# Altium schematic sheet HV_DCDC_EVM_Release_V100.SchDoc
size A2; Organization: Altium Limited; Address1: L3, 12a Rodborough Rd; Address2: Frenchs Forest; Address3: NSW; Address4: Australia 2086; SheetNumber: 1; SheetTotal: 1
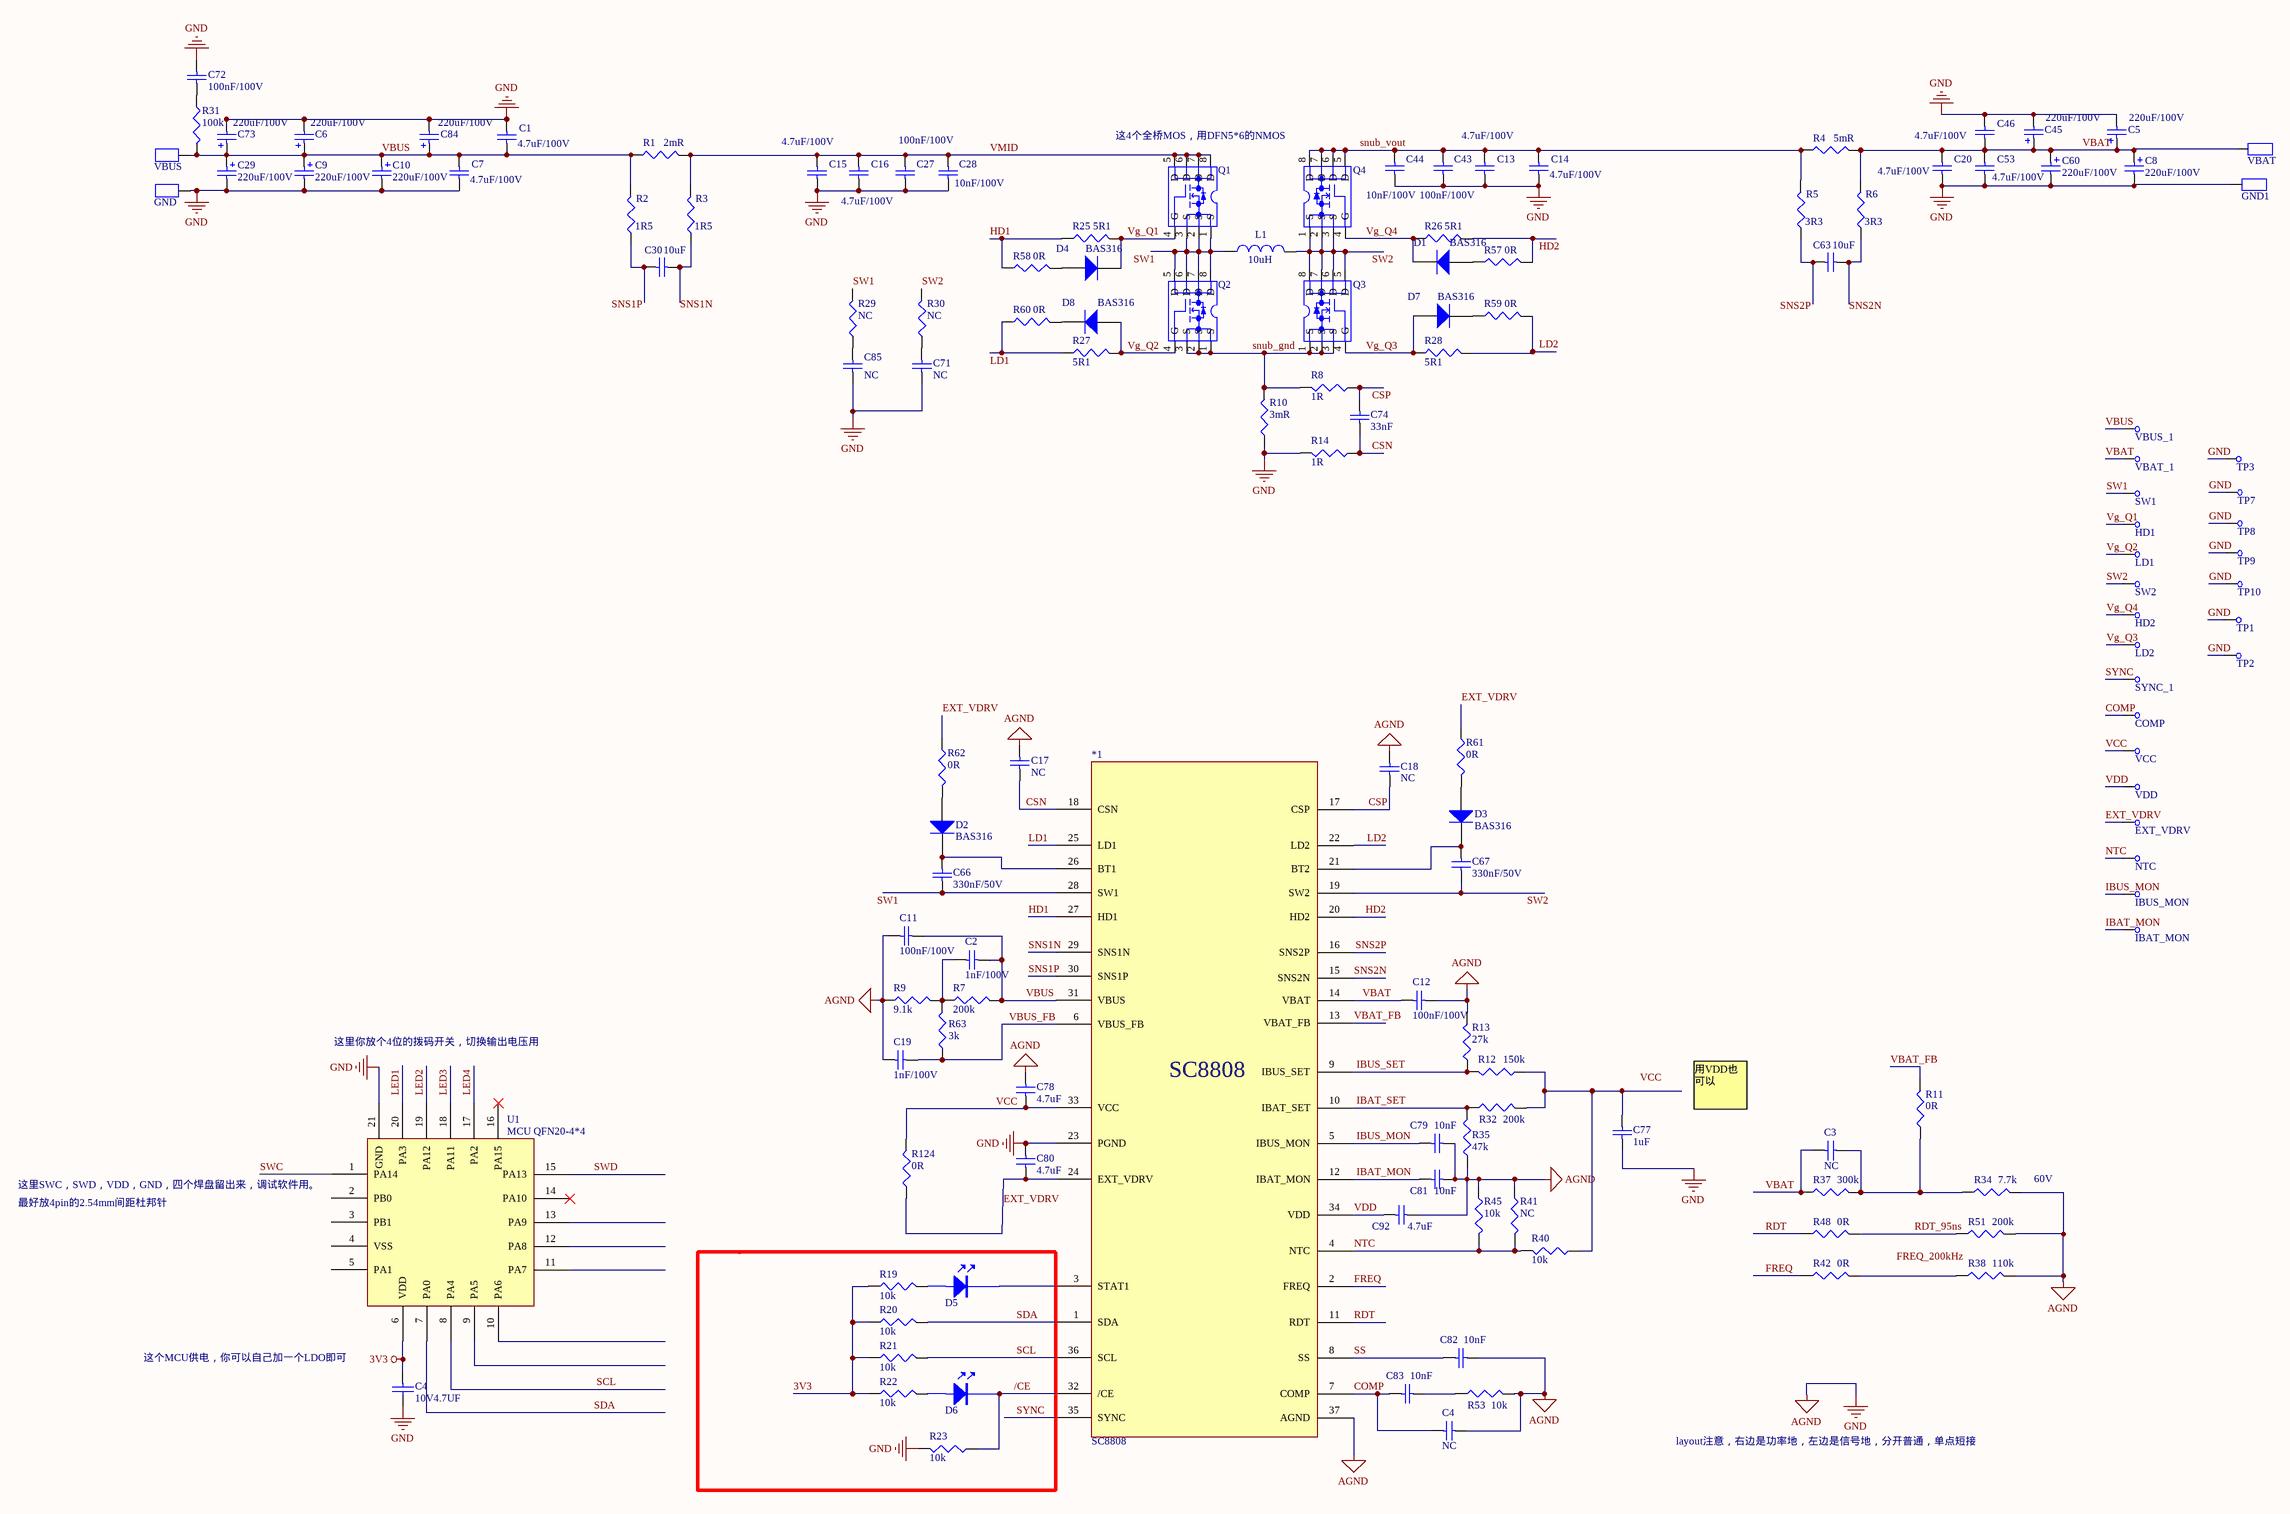
[diagram p0: HV_DCDC_EVM_Release_V100.SchDoc]

## Parts
(Parts that share a designator on the sheet are numbered #1, #2 ... from top to bottom, then left to right.)
*1  SC8808  [QFN-36-5X6]
C1  4.7uF/100V  [C_1210]
C2  1nF/100V  [C_0603]
C3  NC  [C_0603]
C4#1  10V4.7UF  [0603-C]
C4#2  NC  [C_0603]
C5  220uF/100V  [CAP-SMD_BD12.5-L13.0-W13.0-LS14.0-FD]
C6  220uF/100V  [CAP-SMD_BD12.5-L13.0-W13.0-LS14.0-FD]
C7  4.7uF/100V  [C_1210]
C8  220uF/100V  [CAP-SMD_BD12.5-L13.0-W13.0-LS14.0-FD]
C9  220uF/100V  [CAP-SMD_BD12.5-L13.0-W13.0-LS14.0-FD]
C10  220uF/100V  [CAP-SMD_BD12.5-L13.0-W13.0-LS14.0-FD]
C11  100nF/100V  [C_0603]
C12  100nF/100V  [C_0603]
C13  4.7uF/100V  [C_1210]
C14  4.7uF/100V  [C_1210]
C15  4.7uF/100V  [C_1210]
C16  4.7uF/100V  [C_1210]
C17  NC  [C_0603]
C18  NC  [C_0603]
C19  1nF/100V  [C_0603]
C20  4.7uF/100V  [C_1210]
C27  100nF/100V  [C_0603]
C28  10nF/100V  [C_0603]
C29  220uF/100V  [CAP-SMD_BD12.5-L13.0-W13.0-LS14.0-FD]
C30  10uF  [C_0603]
C43  100nF/100V  [C_0603]
C44  10nF/100V  [C_0603]
C45  220uF/100V  [CAP-SMD_BD12.5-L13.0-W13.0-LS14.0-FD]
C46  4.7uF/100V  [C_1210]
C53  4.7uF/100V  [C_1210]
C60  220uF/100V  [CAP-SMD_BD12.5-L13.0-W13.0-LS14.0-FD]
C63  10uF  [C_0603]
C66  330nF/50V  [C_0603]
C67  330nF/50V  [C_0603]
C71  NC  [C_1210]
C72  100nF/100V  [C_1210]
C73  220uF/100V  [CAP-SMD_BD12.5-L13.0-W13.0-LS14.0-FD]
C74  33nF  [C_0603]
C77  1uF  [C_0603]
C78  4.7uF  [C_0603]
C79  10nF  [C_0603]
C80  4.7uF  [C_0603]
C81  10nF  [C_0603]
C82  10nF  [C_0603]
C83  10nF  [C_0603]
C84  220uF/100V  [CAP-SMD_BD12.5-L13.0-W13.0-LS14.0-FD]
C85  NC  [C_1210]
C92  4.7uF  [C_0603]
COMP  TP  [TP-WHITE-Keystone5012]  (value not drawn)
D1  BAS316  [SOD323F]
D2  BAS316  [SOD-123F]
D3  BAS316  [SOD-123F]
D4  BAS316  [SOD323F]
D5  BLUE-LED  [LED0603\TT]  (value not drawn)
D6  BLUE-LED  [LED0603\TT]  (value not drawn)
D7  BAS316  [SOD323F]
D8  BAS316  [SOD323F]
EXT_VDRV  TP  [TP-RED-Keystone5010]  (value not drawn)
GND  JACK  [焊接端子]  (value not drawn)
GND1  JACK  [焊接端子]  (value not drawn)
HD1  TP  [TP-WHITE-Keystone5012]  (value not drawn)
HD2  TP  [TP-WHITE-Keystone5012]  (value not drawn)
IBAT_MON  TP  [TP-WHITE-Keystone5012]  (value not drawn)
IBUS_MON  TP  [TP-WHITE-Keystone5012]  (value not drawn)
L1  10uH  [MWSA2213S]
LD1  TP  [TP-WHITE-Keystone5012]  (value not drawn)
LD2  TP  [TP-WHITE-Keystone5012]  (value not drawn)
NTC  TP  [TP-WHITE-Keystone5012]  (value not drawn)
Q1  NMOS_5X6  [NMOS_5X6]  (value not drawn)
Q2  NMOS_5X6  [NMOS_5X6]  (value not drawn)
Q3  NMOS_5X6  [NMOS_5X6]  (value not drawn)
Q4  NMOS_5X6  [NMOS_5X6]  (value not drawn)
R1  2mR  [RES2512-SMD_L6.4-W3.2-A]
R2  1R5  [R_0603]
R3  1R5  [R_0603]
R4  5mR  [R1225]
R5  3R3  [R_0603]
R6  3R3  [R_0603]
R7  200k  [R_0603]
R8  1R  [R_0603]
R9  9.1k  [R_0603]
R10  3mR  [R1225]
R11  0R  [R_0603]
R12  150k  [R_0603]
R13  27k  [R_0603]
R14  1R  [R_0603]
R19  10k  [R_0603]
R20  10k  [R_0603]
R21  10k  [R_0603]
R22  10k  [R_0603]
R23  10k  [R_0603]
R25  5R1  [R_0603]
R26  5R1  [R_0603]
R27  5R1  [R_0603]
R28  5R1  [R_0603]
R29  NC  [R_1206]
R30  NC  [R_1206]
R31  100k  [R_0805]
R32  200k  [R_0603]
R34  7.7k  [R_0603]
R35  47k  [R_0603]
R37  300k  [R_0603]
R38  110k  [R_0603]
R40  10k  [R_0603]
R41  NC  [R_0603]
R42  0R  [R_0603]
R45  10k  [R_0603]
R48  0R  [R_0603]
R51  200k  [R_0603]
R53  10k  [R_0603]
R57  0R  [R_0603]
R58  0R  [R_0603]
R59  0R  [R_0603]
R60  0R  [R_0603]
R61  0R  [R_0805]
R62  0R  [R_0805]
R63  3k  [R_0603]
R124  0R  [R_0603]
SW1  TP  [TP-WHITE-Keystone5012]  (value not drawn)
SW2  TP  [TP-WHITE-Keystone5012]  (value not drawn)
SYNC_1  TP  [TP-WHITE-Keystone5012]  (value not drawn)
TP1  TP  [TP-BLACK-Keystone5011]  (value not drawn)
TP2  TP  [TP-BLACK-Keystone5011]  (value not drawn)
TP3  TP  [TP-BLACK-Keystone5011]  (value not drawn)
TP7  TP  [TP-BLACK-Keystone5011]  (value not drawn)
TP8  TP  [TP-BLACK-Keystone5011]  (value not drawn)
TP9  TP  [TP-BLACK-Keystone5011]  (value not drawn)
TP10  TP  [TP-BLACK-Keystone5011]  (value not drawn)
U1  MCU QFN20-4*4  [QFN20 3*3 - duplicate]
VBAT  JACK  [焊接端子]  (value not drawn)
VBAT_1  TP  [TP-RED-Keystone5010]  (value not drawn)
VBUS  JACK  [焊接端子]  (value not drawn)
VBUS_1  TP  [TP-RED-Keystone5010]  (value not drawn)
VCC  TP  [TP-RED-Keystone5010]  (value not drawn)
VDD  TP  [TP-RED-Keystone5010]  (value not drawn)

## Nets
3V3: C4#1.1 R19.1 R20.1 R21.1 R22.1 U1.6(VDD)
GND: *1.23(PGND) *1.37(AGND) C1.2 C4#1.2 C4#2.1 C5.2 C6.2 C7.1 C8.2 C9.2 C10.2 C11.2 C12.1 C13.1 C14.1 C15.1 C16.1 C17.2 C18.1 C19.2 C20.1 C27.1 C28.1 C29.2 C43.1 C44.1 C45.2 C46.2 C53.1 C60.2 C71.1 C72.1 C73.2 C77.1 C78.2 C79.1 C80.2 C81.1 C82.1 C84.2 C85.1 C92.1 GND.1 GND1.1 R9.1 R10.1 R13.1 R14.2 R23.2 R34.2 R35.1 R38.2 R41.1 R45.1 R51.2 R53.2 TP1.1 TP2.1 TP3.1 TP7.1 TP8.1 TP9.1 TP10.1 U1.21(GND)  [also labelled AGND]
/CE: *1.32(/CE) D6.2(K) R23.1
COMP: *1.7(COMP) C4#2.2 C83.2 COMP.1
CSN: *1.18(CSN) C17.1 C74.1 R14.1
CSP: *1.17(CSP) C18.2 C74.2 R8.1
EXT_VDRV: *1.24(EXT_VDRV) C80.1 EXT_VDRV.1 R61.1 R62.1 R124.1
FREQ: *1.2(FREQ) R42.1
HD1: *1.27(HD1) R25.1 R58.1
HD2: *1.20(HD2) R26.2 R57.2
IBAT_MON: *1.12(IBAT_MON) C81.2 IBAT_MON.1
IBAT_SET: *1.10(IBAT_SET) R32.1 R35.2
IBUS_MON: *1.5(IBUS_MON) C79.2 IBUS_MON.1
IBUS_SET: *1.9(IBUS_SET) R12.1 R13.2
LD1: *1.25(LD1) R27.1 R60.1
LD2: *1.22(LD2) R28.2 R59.2
LED1: U1.20(PA3)
LED2: U1.19(PA12)
LED3: U1.18(PA11)
LED4: U1.17(PA2)
NTC: *1.4(NTC) NTC.1 R40.2 R41.2 R45.2
RDT: *1.11(RDT) R48.1
RDT_95ns: R48.2 R51.1
SCL: *1.36(SCL) R21.2 U1.8(PA4)
SDA: *1.1(SDA) R20.2 U1.7(PA0)
SNS1N: *1.29(SNS1N) C30.2 R3.1
SNS1P: *1.30(SNS1P) C30.1 R2.1
SNS2N: *1.15(SNS2N) C63.2 R6.1
SNS2P: *1.16(SNS2P) C63.1 R5.1
snub_gnd: Q2.1(S) Q2.2(S) Q2.3(S) Q3.1(S) Q3.2(S) Q3.3(S) R8.2 R10.2
snub_vout: C13.2 C14.2 C43.2 C44.2 Q4.5(D) Q4.6(D) Q4.7(D) Q4.8(D) R4.1 R5.2
SS: *1.8(SS) C82.2
SW1: *1.28(SW1) C66.1 L1.1 Q1.1(S) Q1.2(S) Q1.3(S) Q2.5(D) Q2.6(D) Q2.7(D) Q2.8(D) R29.2 SW1.1
SW2: *1.19(SW2) C67.1 L1.2 Q3.5(D) Q3.6(D) Q3.7(D) Q3.8(D) Q4.1(S) Q4.2(S) Q4.3(S) R30.2 SW2.1
SWC: U1.1(PA14)
SWD: U1.15(PA13)
SYNC: *1.35(SYNC) SYNC_1.1
VBAT: *1.14(VBAT) C3.2 C5.1 C8.1 C12.2 C20.2 C45.1 C46.1 C53.2 C60.1 R4.2 R6.2 R37.1 VBAT.1 VBAT_1.1
VBAT_FB: *1.13(VBAT_FB) R11.2
VBUS: *1.31(VBUS) C1.1 C2.1 C6.1 C7.2 C9.1 C10.1 C11.1 C29.1 C73.1 C84.1 R1.1 R2.2 R7.2 R31.2 VBUS.1 VBUS_1.1
VBUS_FB: *1.6(VBUS_FB) C19.1 R63.1
VCC: *1.33(VCC) C78.1 R124.2 VCC.1
VDD: *1.34(VDD) C92.2 VDD.1
Vg_Q1: D4.2(K) HD1.1 Q1.4(G) R25.2
Vg_Q2: D8.1(A) LD1.1 Q2.4(G) R27.2
Vg_Q3: D7.1(A) LD2.1 Q3.4(G) R28.1
Vg_Q4: D1.2(K) HD2.1 Q4.4(G) R26.1
VMID: C15.2 C16.2 C27.2 C28.2 Q1.5(D) Q1.6(D) Q1.7(D) Q1.8(D) R1.2 R3.2
Net*1_3: *1.3(STAT1) D5.2(K)
Net*1_21: *1.21(BT2) C67.2 D3.2(K)
Net*1_26: *1.26(BT1) C66.2 D2.2(K)
NetC2_2: C2.2 R7.1 R9.2 R63.2
NetC3_1: C3.1 R11.1 R34.1 R37.2
NetC71_2: C71.2 R30.1
NetC72_2: C72.2 R31.1
NetC77_2: C77.2 R12.2 R32.2 R40.1
NetC83_1: C83.1 R53.1
NetC85_2: C85.2 R29.1
NetD1_1: D1.1(A) R57.1
NetD2_1: D2.1(A) R62.2
NetD3_1: D3.1(A) R61.2
NetD4_1: D4.1(A) R58.2
NetD5_1: D5.1(A) R19.2
NetD6_1: D6.1(A) R22.2
NetD7_2: D7.2(K) R59.1
NetD8_2: D8.2(K) R60.2
NetR38_1: R38.1 R42.2

Not connected (* = marked no-connect by the designer): U1 2(PB0) 3(PB1) 4(VSS) 5(PA1) 9(PA5) 10(PA6) 11(PA7) 12(PA8) 13(PA9) 14(PA10)* 16(PA15)*

## Notes on the sheet
- (near Q1) 这4个全桥MOS，用DFN5*6的NMOS
- 这里你放个4位的拨码开关，切换输出电压用
- 用VDD也可以
- 这里SWC，SWD，VDD，GND，四个焊盘留出来，调试软件用。
- 最好放4pin的2.54mm间距杜邦针
- (near R34) 60V
- 这个MCU供电，你可以自己加一个LDO即可
- layout注意，右边是功率地，左边是信号地，分开普通，单点短接
- Labels drawn without touching a wire or pin: FREQ_200kHz, VCC
- Title
- Size:
- Date:
- A4
- Number:
- Time:
- Revision:
- Sheet
- of
- File:

## Library data of the parts
C1 C7 C13-C16 C20 C27 C28 C43 C44 C46 C53 C72 = Cap_1210: Capacitor; Published: 8-Jun-2000; LatestRevisionDate: 17-Jul-2002; LatestRevisionNote: Re-released for DXP Platform.; PackageReference: RAD-0.3; Publisher: Altium Limited; PackageDescription: Radial Cap, Thru-Hole; 2 Leads; 0.3 in Pin Spacing
C2 C3 C4#2 C11 C12 C17-C19 C30 C63 C66 C67 C74 C77-C83 C92 = Cap_0603: Capacitor; Published: 8-Jun-2000; LatestRevisionDate: 17-Jul-2002; LatestRevisionNote: Re-released for DXP Platform.; PackageReference: RAD-0.3; Publisher: Altium Limited; PackageDescription: Radial Cap, Thru-Hole; 2 Leads; 0.3 in Pin Spacing
C4#1 = CAP: 无极性电容
C5 C6 C8-C10 C29 C45 C60 C73 C84 = Cap_ALUM: ALUM Capacitor; Published: 8-Jun-2000; LatestRevisionDate: 17-Jul-2002; LatestRevisionNote: Re-released for DXP Platform.; PackageReference: RB7.6-15; Publisher: Altium Limited; PackageDescription: Polarized Capacitor (Radial); 2 Leads
C71 C85 = Cap_1206: Capacitor; Published: 8-Jun-2000; LatestRevisionDate: 17-Jul-2002; LatestRevisionNote: Re-released for DXP Platform.; PackageReference: RAD-0.3; Publisher: Altium Limited; PackageDescription: Radial Cap, Thru-Hole; 2 Leads; 0.3 in Pin Spacing
COMP EXT_VDRV HD1 HD2 IBAT_MON IBUS_MON LD1 LD2 NTC SW1 SW2 SYNC_1 TP1-TP3 TP7-TP10 VBAT_1 VBUS_1 VCC VDD = TP: test point
D1-D4 D7 D8 = Diode
L1 = Inductor: Code_IEC: 1005; Published: 8-Jun-2000; LatestRevisionDate: 29-May-2009; LatestRevisionNote: IPC-7351 Footprint Added.; PackageReference: 0402-A; Publisher: Altium Limited; PackageDescription: Chip Inductor; Code_JEITA: 0402; Value: 10uH
Q1-Q4 = NMOS_5X6: TDM3740
R1 R4 R29 R30 = R_1206: Resistor; Published: 8-Jun-2000; LatestRevisionDate: 29-May-2009; LatestRevisionNote: IPC-7351 Footprint Added.; PackageReference: J1-0603; Publisher: Altium Limited; PackageDescription: Chip Resistor
R2 R3 R5-R9 R11-R14 R19-R23 R25-R28 R32 R34 R35 R37 R38 R40-R42 R45 R48 R51 R53 R57-R60 R63 R124 = R_0603: Resistor; Published: 8-Jun-2000; LatestRevisionDate: 29-May-2009; LatestRevisionNote: IPC-7351 Footprint Added.; PackageReference: J1-0603; Publisher: Altium Limited; PackageDescription: Chip Resistor
R10 = R_2512: Resistor; Published: 8-Jun-2000; LatestRevisionDate: 29-May-2009; LatestRevisionNote: IPC-7351 Footprint Added.; PackageReference: J1-0603; Publisher: Altium Limited; PackageDescription: Chip Resistor
R31 R61 R62 = R_0805: Resistor; Published: 8-Jun-2000; LatestRevisionDate: 29-May-2009; LatestRevisionNote: IPC-7351 Footprint Added.; PackageReference: J1-0603; Publisher: Altium Limited; PackageDescription: Chip Resistor
U1 = MM32G0001A1N: 灵动微M0单片机